# Altium schematic sheet Driver.SchDoc
size A; SheetNumber: 2; SheetTotal: 6
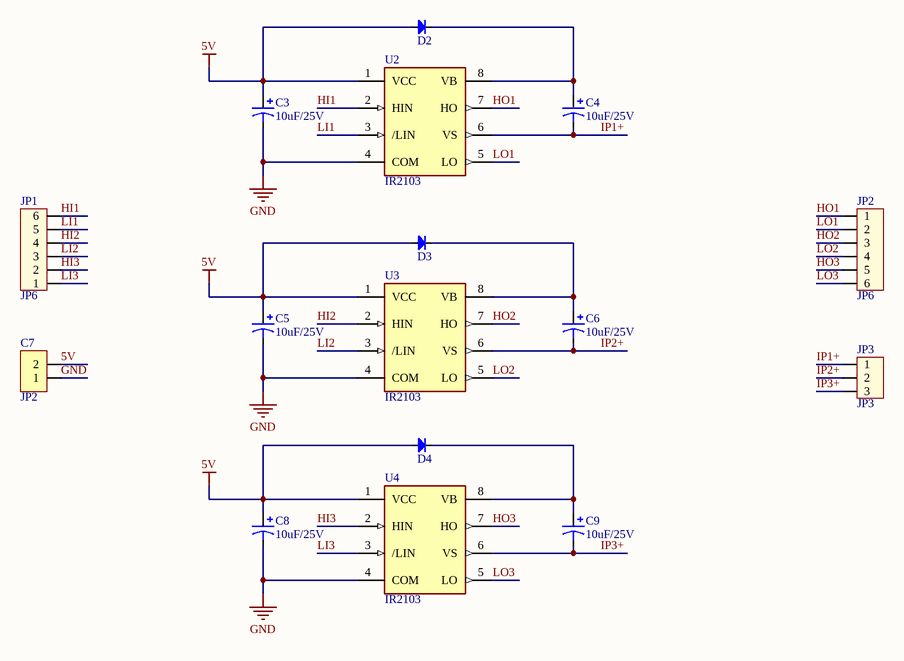
[diagram p0: Driver.SchDoc]

## Parts
C3  10uF/25V  [C3MM]
C4  10uF/25V  [C3MM]
C5  10uF/25V  [C3MM]
C6  10uF/25V  [C3MM]
C7  JP2  [JP2-C1T]
C8  10uF/25V  [C3MM]
C9  10uF/25V  [C3MM]
D2  Diode  [DIO-1A]  (value not drawn)
D3  Diode  [DIO-1A]  (value not drawn)
D4  Diode  [DIO-1A]  (value not drawn)
JP1  JP6  [CON6]
JP2  JP6  [CON6]
JP3  JP3  [CON3]
U2  IR2103  [DIL08]
U3  IR2103  [DIL08]
U4  IR2103  [DIL08]

## Nets
5V: C3.1 C5.1 C7.2 C8.1 D2.1(A) D3.1(A) D4.1(A) U2.1(VCC) U3.1(VCC) U4.1(VCC)
GND: C3.2 C5.2 C7.1 C8.2 U2.4(COM) U3.4(COM) U4.4(COM)
HI1: JP1.6 U2.2(HIN)
HI2: JP1.4 U3.2(HIN)
HI3: JP1.2 U4.2(HIN)
HO1: JP2.1 U2.7(HO)
HO2: JP2.3 U3.7(HO)
HO3: JP2.5 U4.7(HO)
IP1+: C4.2 JP3.1 U2.6(VS)
IP2+: C6.2 JP3.2 U3.6(VS)
IP3+: C9.2 JP3.3 U4.6(VS)
LI1: JP1.5 U2.3(/LIN)
LI2: JP1.3 U3.3(/LIN)
LI3: JP1.1 U4.3(/LIN)
LO1: JP2.2 U2.5(LO)
LO2: JP2.4 U3.5(LO)
LO3: JP2.6 U4.5(LO)
NetC4_1: C4.1 D2.2(K) U2.8(VB)
NetC6_1: C6.1 D3.2(K) U3.8(VB)
NetC9_1: C9.1 D4.2(K) U4.8(VB)

## Library data of the parts
C3-C6 C8 C9 = Cap Pol: Polarized Capacitor (Axial); Published: 8-Jun-2000; LatestRevisionDate: 17-Jul-2002; LatestRevisionNote: Re-released for DXP Platform.; PackageReference: POLAR0.8; Publisher: Altium Limited
C7 = JP2: WR-PHD 2.54 mm Angled Socket Header; Manufacturer: W¨¹rth Elektronik eiSos GmbH; partNo: 613002143121; ComponentLink1 Description: Manufacturer; ComponentLink2 Description: Datasheet; NoPins: 02; Created Date: 29 March 2013; ComponentLink1URL: http://www.we-online.com; ComponentLink2URL: http://katalog.we-online.de/em/datasheet/6130xx143121.pdf; Created by: Karrer Zheng
D2-D4 = Diode: Default Diode; Code - JEDEC: DO-214-AB; Value: 1N5007; Published: 8-Jun-2000; Revision: July-2002: Re-released for DXP Platform.; Publisher: Altium Limited
JP1 JP2 = Con6: Connector 6; Value: Connector 6
JP3 = Con3: Connector 3; Value: Connector 3
U2-U4 = IR2103: Half-Bridge Gate Driver IC Inverting, Non-Inverting 8-PDIP; MF: Infineon; Value: *; Availability: Unavailable; Price: None; Package: DIP-8 International Rectifier; MP: IR2103; SnapEDA_Link: https://www.snapeda.com/parts/IR2103/Infineon%20Technologies/view-part/41870/?ref=snap